# EAGLE schematic dsy01-dock (EAGLE 7.7.0)
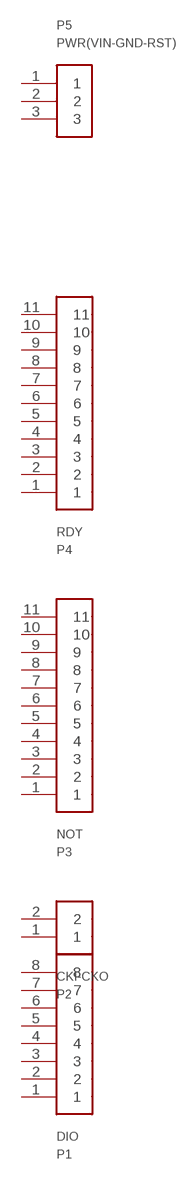
[diagram p0: schematic, sheet 1]

## Parts
P1  DIO  PIN_8  [PIN_8]
P2  CKI-CKO  PIN_2  [PIN_2]
P3  NOT  PIN_11  [PIN_11]
P4  RDY  PIN_11  [PIN_11]
P5  PWR(VIN-GND-RST)  PIN_3  [PIN_3]
Unconnected: P1.1 P1.2 P1.3 P1.4 P1.5 P1.6 P1.7 P1.8 P2.1 P2.2 P3.1 P3.2 P3.3 P3.4 P3.5 P3.6 P3.7 P3.8 P3.9 P3.10 P3.11 P4.1 P4.2 P4.3 P4.4 P4.5 P4.6 P4.7 P4.8 P4.9 P4.10 P4.11 P5.1 P5.2 P5.3

## Library data of the parts
P1 = dooba:PIN_8
P2 = dooba:PIN_2
P3 P4 = dooba:PIN_11
P5 = dooba:PIN_3